# EAGLE schematic usb-power-maker (EAGLE 6.1)
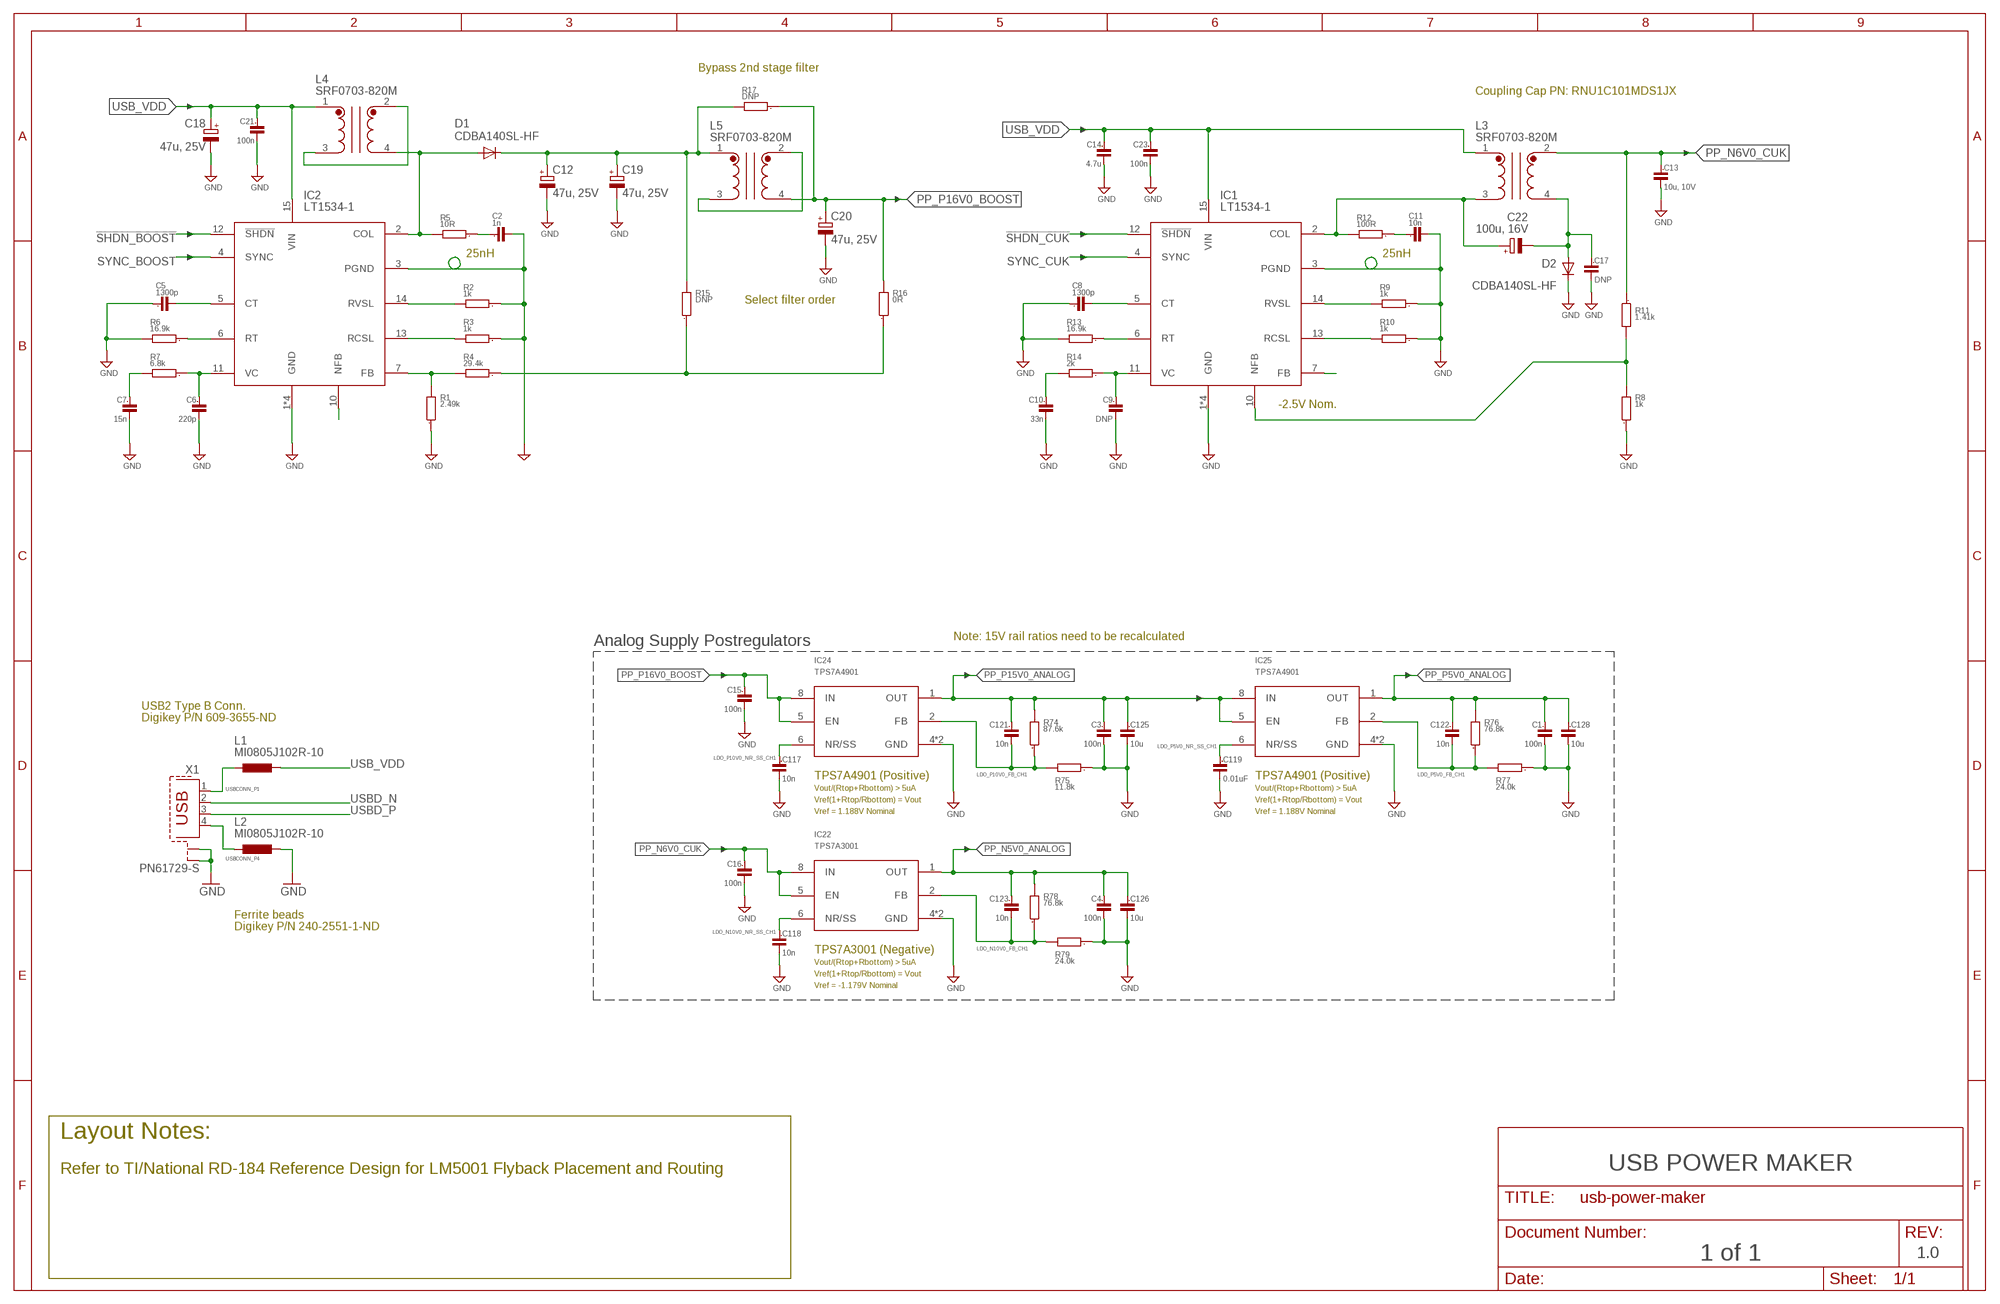
[diagram p0: schematic, sheet 1]

## Parts
C1  100n  C0603  [0603]
C2  1n  C0603  [0603]
C3  100n  C0603  [0603]
C4  100n  C0603  [0603]
C5  1300p  C0603  [0603]
C6  220p  C0603  [0603]
C7  15n  C0603  [0603]
C8  1300p  C0603  [0603]
C9  DNP  C0603  [0603]
C10  33n  C0603  [0603]
C11  10n  C0603  [0603]
C12  47u, 25V  CPOL-EUE2.5-6  [E2,5-6]
C13  10u, 10V  C0805  [0805]
C14  4.7u  C0805  [0805]
C15  100n  C0603  [0603]
C16  100n  C0603  [0603]
C17  DNP  C0603  [0603]
C18  47u, 25V  CPOL-EUE2.5-6  [E2,5-6]
C19  47u, 25V  CPOL-EUE2.5-6  [E2,5-6]
C20  47u, 25V  CPOL-EUE2.5-6  [E2,5-6]
C21  100n  C0603  [0603]
C22  100u, 16V  CPOL-EUE2.5-6  [E2,5-6]
C23  100n  C0603  [0603]
C117  10n  C0603  [0603]
C118  10n  C0603  [0603]
C119  0.01uF  C0603  [0603]
C121  10n  C0603  [0603]
C122  10n  C0603  [0603]
C123  10n  C0603  [0603]
C125  10u  C0805  [0805]
C126  10u  C0805  [0805]
C128  10u  C0805  [0805]
D1  CDBA140SL-HF  DIODE-DO214AC  [DO214AC]
D2  CDBA140SL-HF  DIODE-DO214AC  [DO214AC]
IC1  LT1534-1  LT1534  [SO16]
IC2  LT1534-1  LT1534  [SO16]
IC22  TPS7A3001  TPS7A  [MSOP-8_POWER_PAD]
IC24  TPS7A4901  TPS7A  [MSOP-8_POWER_PAD]
IC25  TPS7A4901  TPS7A  [MSOP-8_POWER_PAD]
L1  MI0805J102R-10  INDUCTOR0805  [R0805]
L2  MI0805J102R-10  INDUCTOR0805  [R0805]
L3  SRF0703-820M  SRF0703  [SRF0703]
L4  SRF0703-820M  SRF0703  [SRF0703]
L5  SRF0703-820M  SRF0703  [SRF0703]
R1  2.49k  R0603  [0603]
R2  1k  R0603  [0603]
R3  1k  R0603  [0603]
R4  29.4k  R0603  [0603]
R5  10R  R0603  [0603]
R6  16.9k  R0603  [0603]
R7  6.8k  R0603  [0603]
R8  1k  R0603  [0603]
R9  1k  R0603  [0603]
R10  1k  R0603  [0603]
R11  1.41k  R0603  [0603]
R12  100R  R0603  [0603]
R13  16.9k  R0603  [0603]
R14  2k  R0603  [0603]
R15  DNP  R0603  [0603]
R16  0R  R0603  [0603]
R17  DNP  R0603  [0603]
R74  87.6k  R0603  [0603]
R75  11.8k  R0603  [0603]
R76  76.8k  R0603  [0603]
R77  24.0k  R0603  [0603]
R78  76.8k  R0603  [0603]
R79  24.0k  R0603  [0603]
X1  PN61729-S  [PN61729-S]

## Nets
!SHDN_BOOST: IC2.12(!SHDN)
!SHDN_CUK: IC1.12(!SHDN)
BOOST_STAGE1: C12.+ C19.+ D1.C L5.1 R15.2 R17.2
GND: C1.2 C2.2 C3.2 C4.2 C5.1 C6.2 C7.2 C8.1 C9.2 C10.2 C11.2 C12.- C13.2 C14.2 C15.2 C16.2 C17.2 C18.- C19.- C20.- C21.2 C23.2 C117.2 C118.2 C119.2 C125.2 C126.2 C128.2 D2.C IC1.1(GND) IC1.3(PGND) IC1.8(GND) IC1.9(GND) IC1.16(GND) IC2.1(GND) IC2.3(PGND) IC2.8(GND) IC2.9(GND) IC2.16(GND) IC22.4(GND) IC22.PAD(GND) IC24.4(GND) IC24.PAD(GND) IC25.4(GND) IC25.PAD(GND) L2.2 R1.1 R2.1 R3.1 R6.2 R8.1 R9.1 R10.1 R13.2 R75.1 R77.1 R79.1 X1.S1 X1.S2
LDO_N10V0_FB_CH1: C123.2 IC22.2(FB) R78.1 R79.2
LDO_N10V0_NR_SS_CH1: C118.1 IC22.6(NR/SS)
LDO_P5V0_FB_CH1: C122.2 IC25.2(FB) R76.1 R77.2
LDO_P5V0_NR_SS_CH1: C119.1 IC25.6(NR/SS)
LDO_P10V0_FB_CH1: C121.2 IC24.2(FB) R74.1 R75.2
LDO_P10V0_NR_SS_CH1: C117.1 IC24.6(NR/SS)
N$1: IC2.7(FB) R1.2 R4.2
N$2: IC2.13(RCSL) R3.2
N$3: L4.2 L4.3
N$4: L5.2 L5.3
N$6: IC2.14(RVSL) R2.2
N$7: D1.A IC2.2(COL) L4.4 R5.2
N$8: C2.1 R5.1
N$9: C7.1 R7.2
N$10: R4.1 R15.1 R16.1
N$12: IC2.10(NFB)
N$13: IC1.7(FB)
N$14: IC1.13(RCSL) R10.2
N$15: C6.1 IC2.11(VC) R7.1
N$16: IC2.6(RT) R6.1
N$17: C5.2 IC2.5(CT)
N$18: IC1.14(RVSL) R9.2
N$19: C17.1 C22.- D2.A L3.4
N$20: C11.1 R12.1
N$23: C10.1 R14.2
N$24: C9.1 IC1.11(VC) R14.1
N$25: IC1.6(RT) R13.1
N$26: C8.2 IC1.5(CT)
N$27: IC1.10(NFB) R8.2 R11.2
N$28: C22.+ IC1.2(COL) L3.3 R12.2
PP_N5V0_ANALOG: C4.1 C123.1 C126.1 IC22.1(OUT) R78.2
PP_N6V0_CUK: C13.1 C16.1 IC22.5(EN) IC22.8(IN) L3.2 R11.1
PP_P5V0_ANALOG: C1.1 C122.1 C128.1 IC25.1(OUT) R76.2
PP_P15V0_ANALOG: C3.1 C121.1 C125.1 IC24.1(OUT) IC25.5(EN) IC25.8(IN) R74.2
PP_P16V0_BOOST: C15.1 C20.+ IC24.5(EN) IC24.8(IN) L5.4 R16.2 R17.1
SYNC_BOOST: IC2.4(SYNC)
SYNC_CUK: IC1.4(SYNC)
USB_VDD: C14.1 C18.+ C21.1 C23.1 IC1.15(VIN) IC2.15(VIN) L1.2 L3.1 L4.1
USBCONN_P1: L1.1 X1.1
USBCONN_P4: L2.1 X1.4
USBD_N: X1.2
USBD_P: X1.3

## Notes on the sheet
- Bypass 2nd stage filter
- Coupling Cap PN: RNU1C101MDS1JX
- 25nH | 25nH
- Select filter order
- -2.5V Nom.
- Note: 15V rail ratios need to be recalculated
- Analog Supply Postregulators
- USB2 Type B Conn.
- Digikey P/N 609-3655-ND
- TPS7A4901 (Positive) | TPS7A4901 (Positive)
- Vout/(Rtop+Rbottom) > 5uA | Vout/(Rtop+Rbottom) > 5uA
- Vref(1+Rtop/Rbottom) = Vout | Vref(1+Rtop/Rbottom) = Vout
- Vref = 1.188V Nominal | Vref = 1.188V Nominal
- Ferrite beads
- Digikey P/N 240-2551-1-ND
- TPS7A3001 (Negative)
- Vout/(Rtop+Rbottom) > 5uA
- Vref(1+Rtop/Rbottom) = Vout
- Vref = -1.179V Nominal
- Layout Notes:
- USB POWER MAKER
- Refer to TI/National RD-184 Reference Design for LM5001 Flyback Placement and Routing
- 1 of 1 | 1.0

## Library data of the parts
C1-C11 C13-C17 C21 C23 C117-C119 C121-C123 C125 C126 C128 = Bogdan_Commons:C: CAPACITOR, European symbol
C12 C18-C20 C22 = rcl:CPOL-EU: POLARIZED CAPACITOR, European symbol
D1 D2 = diode:DIODE-: DIODE
IC1 IC2 = meng:LT1534
IC22 IC24 IC25 = Kramnik's Library:TPS7A*
L1 L2 = meng:INDUCTOR
L3-L5 = meng:SRF0703; VALUE: SRF0703
R1-R17 R74-R79 = GadgetFactory:R: RESISTOR, European symbol
X1 = con-berg:PN61729-S: BERG USB connector; OC_FARNELL: unknown; OC_NEWARK: unknown

## Net classes
0 default: width 0.203 mm, drill 0.381 mm, clearance 0.203 mm